# EAGLE schematic V4-AddOnLeer-V001 (EAGLE 9.3.0)
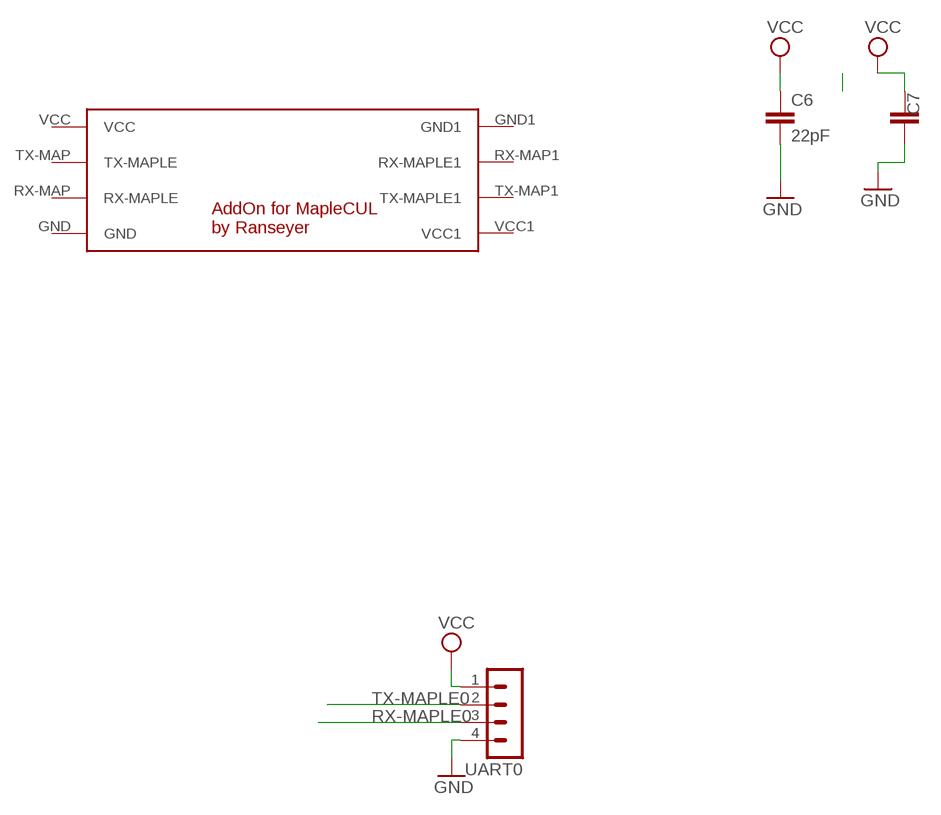
[diagram p0: schematic, sheet 1]

## Parts
C6  22pF  C-EUC0805  [C0805]
C7  C-EUC1812  [C1812]
U$1  MAPLE-CUL-ADDON-V01  [MAPLE-CUL-V01]
UART0  MA04-1  [MA04-1]

## Nets
GND [PWR]: C6.2 C7.1 UART0.4
RX-MAPLE0: UART0.3
TX-MAPLE0: UART0.2
VCC [PWR]: C6.1 C7.2 UART0.1
Unconnected: U$1.GND U$1.GND1 U$1.RX-MAP1(RX-MAPLE1) U$1.RX-MAP(RX-MAPLE) U$1.TX-MAP1(TX-MAPLE1) U$1.TX-MAP(TX-MAPLE) U$1.VCC U$1.VCC1

## Library data of the parts
C6 C7 = rcl:C-EU: CAPACITOR, European symbol; SPICEPREFIX: C
U$1 = Martin-Communication-V4:MAPLE-CUL-ADDON-V01: AddOn for MAPLE-CUL V4.x
UART0 = con-lstb:MA04-1: PIN HEADER; OC_FARNELL: unknown; OC_NEWARK: unknown

## Net classes
0 default: width 0.305 mm
1 PWR: width 0.61 mm